# Altium schematic sheet Ryan.SchDoc
size A; SheetNumber: 5; SheetTotal: 6
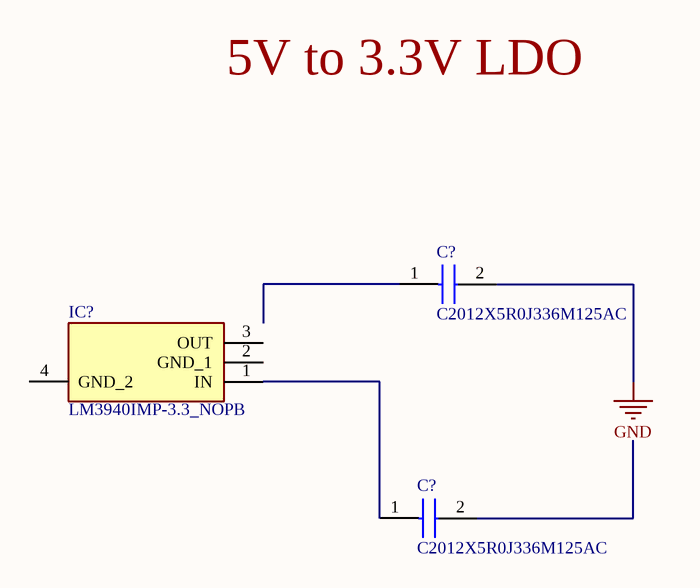
[diagram p0: Ryan.SchDoc]

## Parts
(Parts that share a designator on the sheet are numbered #1, #2 ... from top to bottom, then left to right.)
C?#1  C2012X5R0J336M125AC  [CAPC2012X145N]
C?#2  C2012X5R0J336M125AC  [CAPC2012X145N]
IC?  LM3940IMP-3.3_NOPB  [SOT230P700X180-4N]

## Nets
GND: C?#1.2
NetC?#2_1: C?#2.1 IC?.1(IN)

Not connected (* = marked no-connect by the designer): C?#1 1; C?#2 2; IC? 2(GND_1) 3(OUT) 4(GND_2)

## Notes on the sheet
- 5V to 3.3V LDO

## Library data of the parts
C?#1 C?#2 = C2012X5R0J336M125AC: Capacitor; Manufacturer_Name: TDK; Datasheet Link: https://product.tdk.com/info/en/catalog/datasheets/mlcc_commercial_midvoltage_en.pdf; Height: 1.45mm; Manufacturer_Part_Number: C2012X5R0J336M125AC; Mouser Part Number: 810-C2012X5R0J336M; Mouser Price/Stock: https://www.mouser.co.uk/ProductDetail/TDK/C2012X5R0J336M125AC?qs=dfay7wIA1uEz8IOrvQUw5Q%3D%3D; Arrow Part Number: C2012X5R0J336M125AC; Arrow Price/Stock: https://www.arrow.com/en/products/c2012x5r0j336m125ac/tdk?region=nac
IC? = LM3940IMP-3.3_NOPB: Integrated Circuit; Manufacturer_Name: Texas Instruments; Manufacturer_Part_Number: LM3940IMP-3.3/NOPB; Datasheet Link: http://www.ti.com/lit/ds/symlink/lm3940.pdf; Height: 1.8mm; Mouser Part Number: 926-LM3940IMP3.3NOPB; Mouser Price/Stock: https://www.mouser.co.uk/ProductDetail/Texas-Instruments/LM3940IMP-3.3-NOPB?qs=QbsRYf82W3EIVCEt3IRFTQ%3D%3D; Arrow Part Number: LM3940IMP-3.3/NOPB; Arrow Price/Stock: https://www.arrow.com/en/products/lm3940imp-3.3nopb/texas-instruments?region=nac